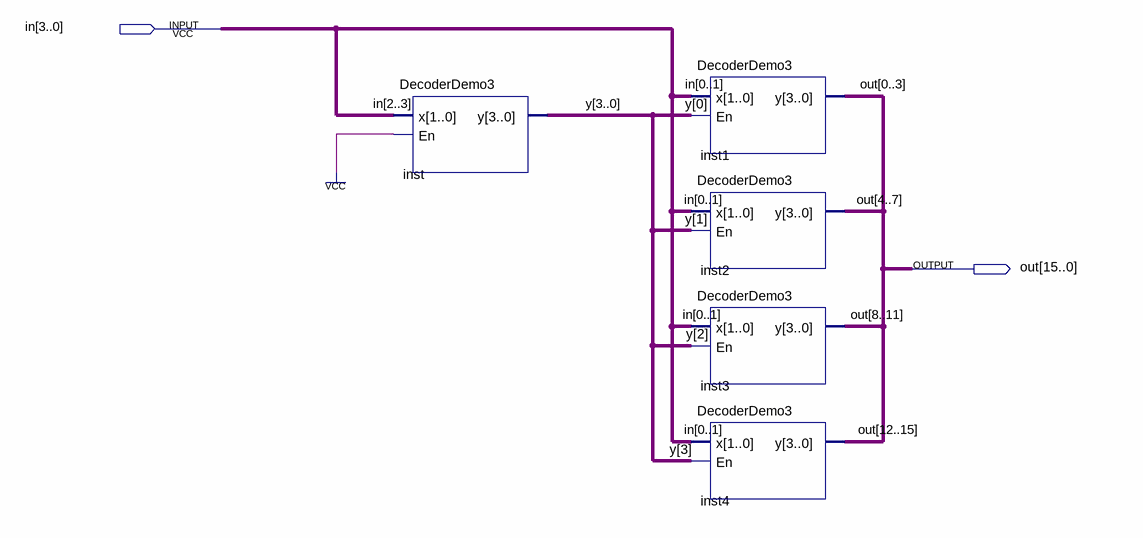
[diagram p0: schematic sheet]
// Quartus schematic Decoder4_16.bdf as structural Verilog: 5 symbols, 2 pins
module Decoder4_16 (
  input  [3:0] in,
  output [15:0] out
);

  wire [3:0] y;

  DecoderDemo3 inst (.x({in[2], in[3]}), .En(1'b1), .y(y));
  DecoderDemo3 inst1 (.x({in[0], in[1]}), .En(y[0]), .y({out[0], out[1], out[2], out[3]}));
  DecoderDemo3 inst2 (.x({in[0], in[1]}), .En(y[1]), .y({out[4], out[5], out[6], out[7]}));
  DecoderDemo3 inst3 (.x({in[0], in[1]}), .En(y[2]), .y({out[8], out[9], out[10], out[11]}));
  DecoderDemo3 inst4 (.x({in[0], in[1]}), .En(y[3]), .y({out[12], out[13], out[14], out[15]}));
endmodule
